# Altium schematic sheet Pasa Altos.SchDoc
size A4
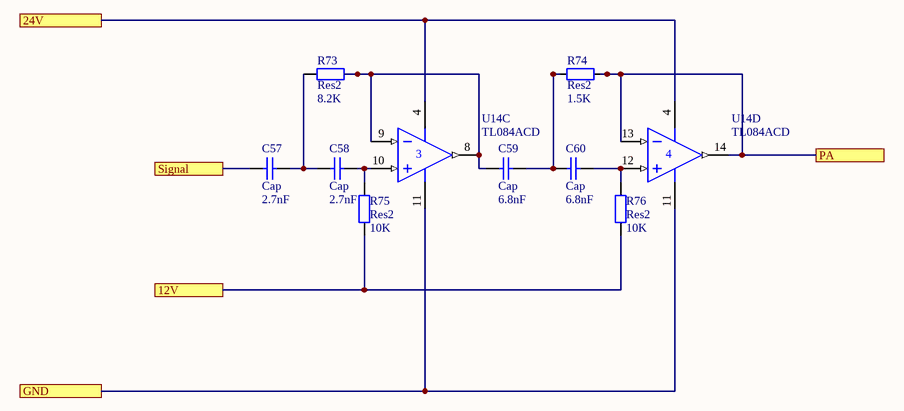
[diagram p0: Pasa Altos.SchDoc]

## Parts
C57  Cap  value 2.7nF  [rad-0.2]
C58  Cap  value 2.7nF  [rad-0.2]
C59  Cap  value 6.8nF  [rad-0.2]
C60  Cap  value 6.8nF  [rad-0.2]
R73  Res2  value 8.2K  [1206 resistor]
R74  Res2  value 1.5K  [1206 resistor]
R75  Res2  value 10K  [1206 resistor]
R76  Res2  value 10K  [1206 resistor]
U14  TL084ACD  [751A-02_N]  (parts C,D of 4)

## Ports
12V, 24V, GND, PA, Signal

## Nets
12V: R75.1 R76.1 ; port 12V
24V: U14.4(V+) ; port 24V
GND: U14.11(V-) ; port GND
PA: R74.2 U14.13(IN-) U14.14(OUT) ; port PA
Signal: C57.2 ; port Signal
NetC57_1: C57.1 C58.2 R73.1
NetC58_1: C58.1 R75.2 U14.10(IN+)
NetC59_1: C59.1 C60.2 R74.1
NetC59_2: C59.2 R73.2 U14.8(OUT) U14.9(IN-)
NetC60_1: C60.1 R76.2 U14.12(IN+)

## Library data of the parts
C57-C60 = Cap: Capacitor; Published: 8-Jun-2000; LatestRevisionDate: 17-Jul-2002; LatestRevisionNote: Re-released for DXP Platform.; PackageReference: RAD-0.3; Publisher: Altium Limited; PackageDescription: Radial Cap, Thru-Hole; 2 Leads; 0.3 in Pin Spacing
R73-R76 = Res2: Resistor; Published: 8-Jun-2000; LatestRevisionDate: 17-Jul-2002; LatestRevisionNote: Re-released for DXP Platform.; PackageReference: AXIAL-0.4; Publisher: Altium Limited; PackageDescription: Axial Device, Thru-Hole; 2 Leads; 0.4 in Pin Spacing
U14 = TL084ACD: JFET-Input Operational Amplifier; Published: 17-Jul-2002; LatestRevisionDate: 13-Apr-2006; LatestRevisionNote: IPC-7351 Footprint Added.; DatasheetVersion: 1988; PackageVersion: 1991; PackageReference: 751A-02; Publisher: Altium Limited; PackageDescription: 14-Pin Small Outline Integrated Circuit 1.27 mm Pitch; Code_IPC: SOIC127P600-14; ComponentLink1Description: Manufacturer Link; ComponentLink1URL: http://www.onsemi.com/site/products/parametrics/0,4446,251,00.html